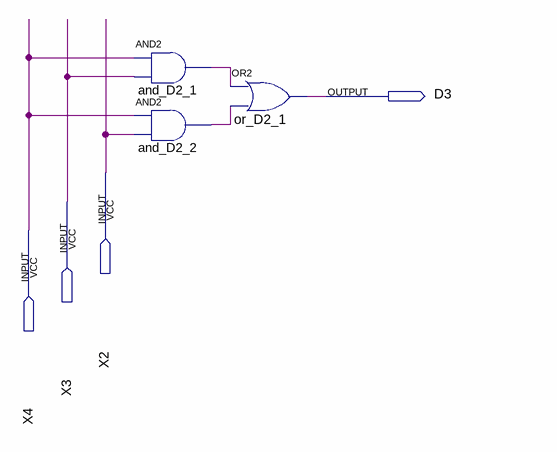
[diagram p0: schematic sheet]
// Quartus schematic conv_D3.bdf as structural Verilog: 3 symbols, 4 pins
module conv_D3 (
  input  X2,
  input  X3,
  input  X4,
  output D3
);

  wire and_D2_1_out, and_D2_2_out;

  and and_D2_1 (and_D2_1_out, X4, X3);
  and and_D2_2 (and_D2_2_out, X4, X2);
  or or_D2_1 (D3, and_D2_1_out, and_D2_2_out);
endmodule
